# EAGLE design smits-board (EAGLE 9.5.2)
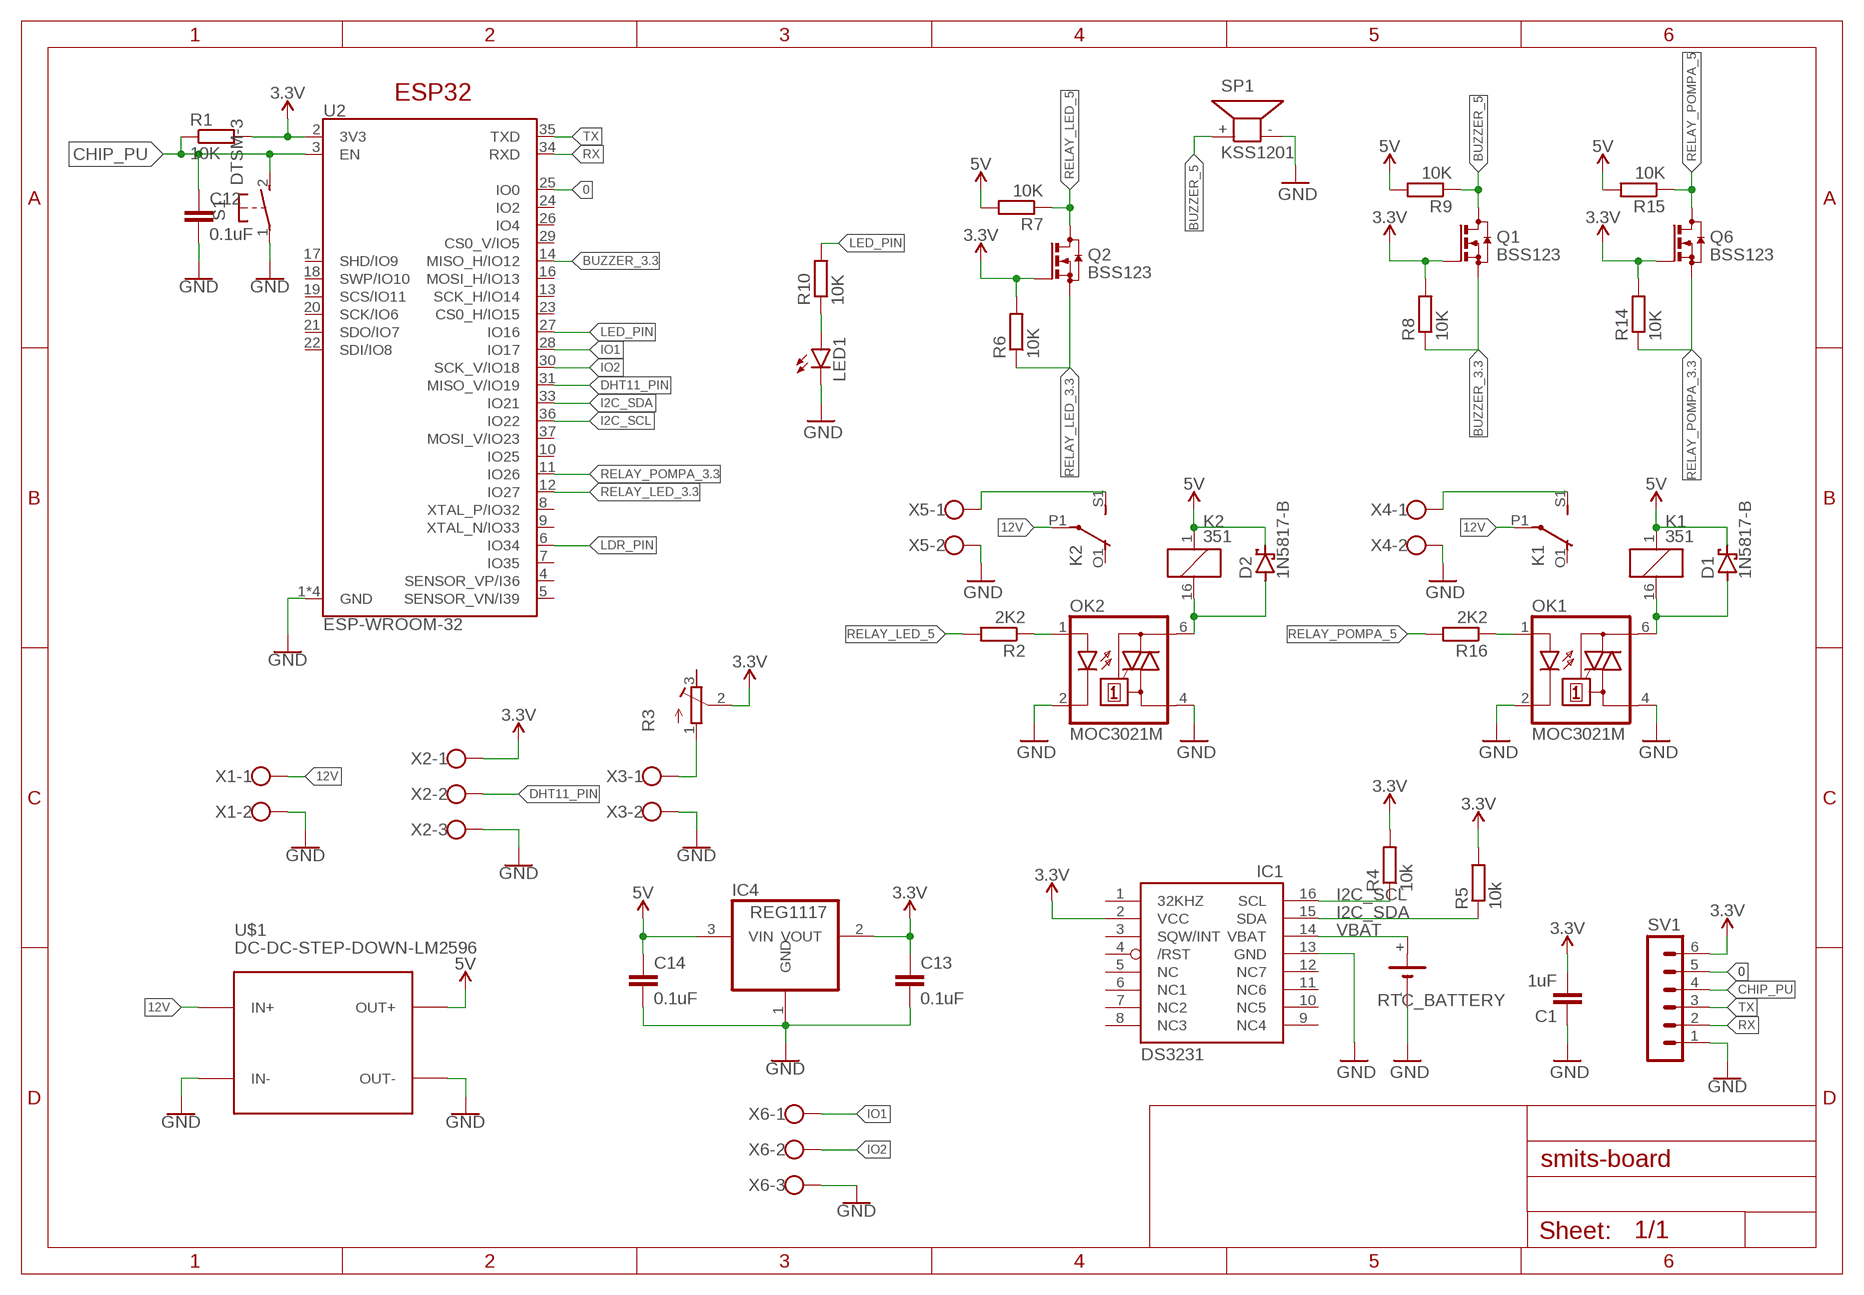
[diagram p0: schematic, sheet 1]

## Parts
C1  1uF  C-EUC0805  [C0805]
C12  0.1uF  C-EUC0805  [C0805]
C13  0.1uF  C-EUC0805  [C0805]
C14  0.1uF  C-EUC0805  [C0805]
D1  1N5817-B  [DO41-7.6]
D2  1N5817-B  [DO41-7.6]
IC1  DS3231/SO  [SO16W]
IC4  REG1117  [SOT223]
K1  351  [351]
K2  351  [351]
LED1  LEDCHIP-LED0805  [CHIP-LED0805]
OK1  MOC3021M  [DIL06]
OK2  MOC3021M  [DIL06]
Q1  BSS123  [SOT23]
Q2  BSS123  [SOT23]
Q6  BSS123  [SOT23]
R1  10K  R-EU_R0805  [R0805]
R2  2K2  R-EU_R0805  [R0805]
R3  R-TRIMM64W  [RTRIM64W]
R4  10k  R-EU_R0805  [R0805]
R5  10k  R-EU_R0805  [R0805]
R6  10K  R-EU_R0805  [R0805]
R7  10K  R-EU_R0805  [R0805]
R8  10K  R-EU_R0805  [R0805]
R9  10K  R-EU_R0805  [R0805]
R10  10K  R-EU_R0805  [R0805]
R14  10K  R-EU_R0805  [R0805]
R15  10K  R-EU_R0805  [R0805]
R16  2K2  R-EU_R0805  [R0805]
RTC_BATTERY  CH291-1220LF  [CH291-1220LF]
S1  DTSM-3  [DTSM-3]
SP1  KSS1201  [KSS1201]
SV1  MA06-1  [MA06-1]
U2  ESP-WROOM-32  [ESP-WROOM-32]
U$1  DC-DC-STEP-DOWN-LM2596  [DC-DC-STEP-DOWN-LM2596]
X1  W237-102  [W237-102]
X2  W237-103  [W237-103]
X3  W237-102  [W237-102]
X4  W237-102  [W237-102]
X5  W237-102  [W237-102]
X6  W237-103  [W237-103]

## Nets
0: SV1.5 U2.25(IO0)
12V: K1.P1(2:P) K2.P1(2:P) U$1.IN+ X1.1
BUZZER_3.3: Q1.2(S) R8.1 U2.14(MISO_H/IO12)
BUZZER_5: Q1.3(D) R9.1 SP1.+
CHIP_PU: C12.1 R1.1 S1.2 SV1.4 U2.3(EN)
DHT11_PIN: U2.31(MISO_V/IO19) X2.2
GND: C1.1 C12.2 C13.2 C14.2 IC1.13(GND) IC4.1(GND) LED1.C OK1.2(C) OK1.4(A1) OK2.2(C) OK2.4(A1) RTC_BATTERY.- S1.1 SP1.- SV1.1 U2.1(GND) U2.15(GND) U2.38(GND) U2.GND U$1.IN- U$1.OUT- X1.2 X2.3 X3.2 X4.2 X5.2 X6.3
I2C_SCL: IC1.16(SCL) R4.1 U2.36(IO22)
I2C_SDA: IC1.15(SDA) R5.1 U2.33(IO21)
IO1: U2.28(IO17) X6.1
IO2: U2.30(SCK_V/IO18) X6.2
LDR_PIN: U2.6(IO34)
LED_PIN: R10.2 U2.27(IO16)
N$1: R3.1(A) X3.1
N$2: D1.A K1.16 OK1.6(A2)
N$3: OK1.1(A) R16.1
N$4: D2.A K2.16 OK2.6(A2)
N$5: LED1.A R10.1
N$6: K1.S1(2:S) X4.1
N$7: OK2.1(A) R2.1
N$9: K2.S1(2:S) X5.1
RELAY_LED_3.3: Q2.2(S) R6.1 U2.12(IO27)
RELAY_LED_5: Q2.3(D) R2.2 R7.1
RELAY_POMPA_3.3: Q6.2(S) R14.1 U2.11(IO26)
RELAY_POMPA_5: Q6.3(D) R15.1 R16.2
RX: SV1.2 U2.34(RXD)
TX: SV1.3 U2.35(TXD)
VBAT: IC1.14(VBAT) RTC_BATTERY.+
VCC_1: C1.2 C13.1 IC1.2(VCC) IC4.2(VOUT) Q1.1(G) Q2.1(G) Q6.1(G) R1.2 R3.2(S) R4.2 R5.2 R6.2 R8.2 R14.2 SV1.6 U2.2(3V3) X2.1 ; supply symbol labelled 3.3V
VCC_2: C14.1 D1.C D2.C IC4.3(VIN) K1.1 K2.1 R7.2 R9.2 R15.2 U$1.OUT+ ; supply symbol labelled 5V
Unconnected: IC1.1(32KHZ) IC1.3(SQW/INT) IC1.4(/RST) IC1.5(NC) IC1.6(NC1) IC1.7(NC2) IC1.8(NC3) IC1.9(NC4) IC1.10(NC5) IC1.11(NC6) IC1.12(NC7) K1.O1(2:O) K1.O2(3:O) K1.P2(3:P) K1.S2(3:S) K2.O1(2:O) K2.O2(3:O) K2.P2(3:P) K2.S2(3:S) R3.3(E) U2.4(SENSOR_VP/I36) U2.5(SENSOR_VN/I39) U2.7(IO35) U2.8(XTAL_P/IO32) U2.9(XTAL_N/IO33) U2.10(IO25) U2.13(SCK_H/IO14) U2.16(MOSI_H/IO13) U2.17(SHD/IO9) U2.18(SWP/IO10) U2.19(SCS/IO11) U2.20(SCK/IO6) U2.21(SDO/IO7) U2.22(SDI/IO8) U2.23(CS0_H/IO15) U2.24(IO2) U2.26(IO4) U2.29(CS0_V/IO5) U2.37(MOSI_V/IO23)

## Notes on the sheet
- ESP32

## Library data of the parts
C1 C12 = rcl:C-EU: CAPACITOR, European symbol; SPICEPREFIX: C
C13 C14 = resistor:C-EU: CAPACITOR, European symbol
D1 D2 = diode:1N581*: 1.0A SCHOTTKY BARRIER RECTIFIER Source: http://www.diodes.com/datasheets/ds23001.pdf
IC1 = adafruit:DS3231
IC4 = burr-brown:REG1117: 800mA and 1A Low Dropout (LDO) Positive Regulator 1.8V, 2.5V, 2.85V, 3.3V, 5V, and Adj; MPN: REG1117; OC_FARNELL: 1097566; OC_NEWARK: 14P6981
K1 K2 = relay:351: RELAY 2 x switch, Omron; OC_FARNELL: unknown; OC_NEWARK: unknown
LED1 = led:LED: LED OSRAM: - CHIPLED LG R971, LG N971, LY N971, LG Q971, LY Q971, LO R971, LY R971 LH N974, LH R974 LS Q976, LO Q976, LY Q976 LO Q996 - Hyper CHIPLED LW Q18S LB Q993, LB Q99A, LB R99A - SideLED LS A670, LO A670, LY A670, LG A670, LP A670 LB A673, LV A673, LT A673, LW A673 LH A674 LY A675 LS A676, LA A676, LO A676, LY A676, LW A676 LS A679, LY A679, LG A679 - Hyper Micro SIDELED® LS Y876, LA Y876, LO Y876, LY Y876 LT Y87S - SmartLED LW L88C, LW L88S LB L89C, LB L89S, LG L890 LS L89K, LO L89K, LY L89K LS L896, LA L896, LO L896, LY L896 - TOPLED LS T670, LO T670, LY T670, LG T670, LP T670 LSG T670, LSP T670, LSY T670, LOP T670, LYG T670 LG T671, LOG T671, LSG T671 LB T673, LV T673, LT T673, LW T673 LH T674 LS T676, LA T676, LO T676, LY T676, LB T676, LH T676, LSB T676, LW T676 LB T67C, LV T67C, LT T67C, LS T67K, LO T67K, LY T67K, LW E67C LS E67B, LA E67B, LO E67B, LY E67B, LB E67C, LV E67C, LT E67C LW T67C LS T679, LY T679, LG T679 LS T770, LO T770, LY T770, LG T770, LP T770 LB T773, LV T773, LT T773, LW T773 LH T774 LS E675, LA E675, LY E675, LS T675 LS T776, LA T776, LO T776, LY T776, LB T776 LHGB T686 LT T68C, LB T68C - Hyper Mini TOPLED® LB M676 - Mini TOPLED Santana® LG M470 LS M47K, LO M47K, LY M47K Source: http://www.osram.convergy.de LUXEON: - LUMILED® LXK2-PW12-R00, LXK2-PW12-S00, LXK2-PW14-U00, LXK2-PW14-V00 LXK2-PM12-R00, LXK2-PM12-S00, LXK2-PM14-U00 LXK2-PE12-Q00, LXK2-PE12-R00, LXK2-PE12-S00, LXK2-PE14-T00, LXK2-PE14-U00 LXK2-PB12-K00, LXK2-PB12-L00, LXK2-PB12-M00, LXK2-PB14-N00, LXK2-PB14-P00, LXK2-PB14-Q00 LXK2-PR12-L00, LXK2-PR12-M00, LXK2-PR14-Q00, LXK2-PR14-R00 LXK2-PD12-Q00, LXK2-PD12-R00, LXK2-PD12-S00 LXK2-PH12-R00, LXK2-PH12-S00 LXK2-PL12-P00, LXK2-PL12-Q00, LXK2-PL12-R00 Source: www.luxeon.com KINGBRIGHT: KA-3528ASYC Source: www.kingbright.com
OK1 OK2 = optocoupler:MOC30*M: RANDOM-PHASE OPTOISOLATORS TRIAC DRIVER OUTPUT Source: http://www.fairchildsemi.com MOC3020-M.pdf; MF: FAIRCHILD SEMICONDUCTOR; MPN: MOC3021-M; OC_FARNELL: 1021365; OC_NEWARK: 95B7895
Q1 Q2 Q6 = transistor-small-signal:BSS123: N-CHANNEL MOS FET
R1 R4 R5 = rcl:R-EU_: RESISTOR, European symbol; SPICEPREFIX: R
R2 R6-R10 R14-R16 = resistor:R-EU_: RESISTOR, European symbol
R3 = rcl:R-TRIMM: Trimm resistor; SPICEMODEL: X; SPICEPREFIXL: POT
RTC_BATTERY = battery:CH291-1220LF: Battery Holder, SMT, 12mm multicomp PART NO. CH291-1220LF Source: Data sheet <http://www.farnell.com/datasheets/1505860.pdf>
S1 = switch-tact:DTSM-3
SP1 = buzzer:KSS1201: SPEAKER Source: Schukat; OC_FARNELL: unknown; OC_NEWARK: unknown
SV1 = con-lstb:MA06-1: PIN HEADER; OC_FARNELL: unknown; OC_NEWARK: unknown
U2 = SparkFun-RF:ESP-WROOM-32; PROD_ID: IC-13849
U$1 = diy-modules:DC-DC-STEP-DOWN-LM2596: DC/DC Step-Down Regulator based on LM2596-ADJ chip LM2596 datasheet available here: http://www.ti.com/lit/ds/symlink/lm2596.pdf Click here to find device on ebay.com <http://www.ebay.com/sch/lm2596+power+regulator>
X1 X3-X5 = con-wago-500:W237-102: WAGO SCREW CLAMP; MPN: 237-102; OC_FARNELL: unknown; OC_NEWARK: 70K9898
X2 X6 = con-wago-500:W237-103: WAGO SCREW CLAMP; MPN: 237-103; OC_FARNELL: unknown; OC_NEWARK: 18M7116

## Board
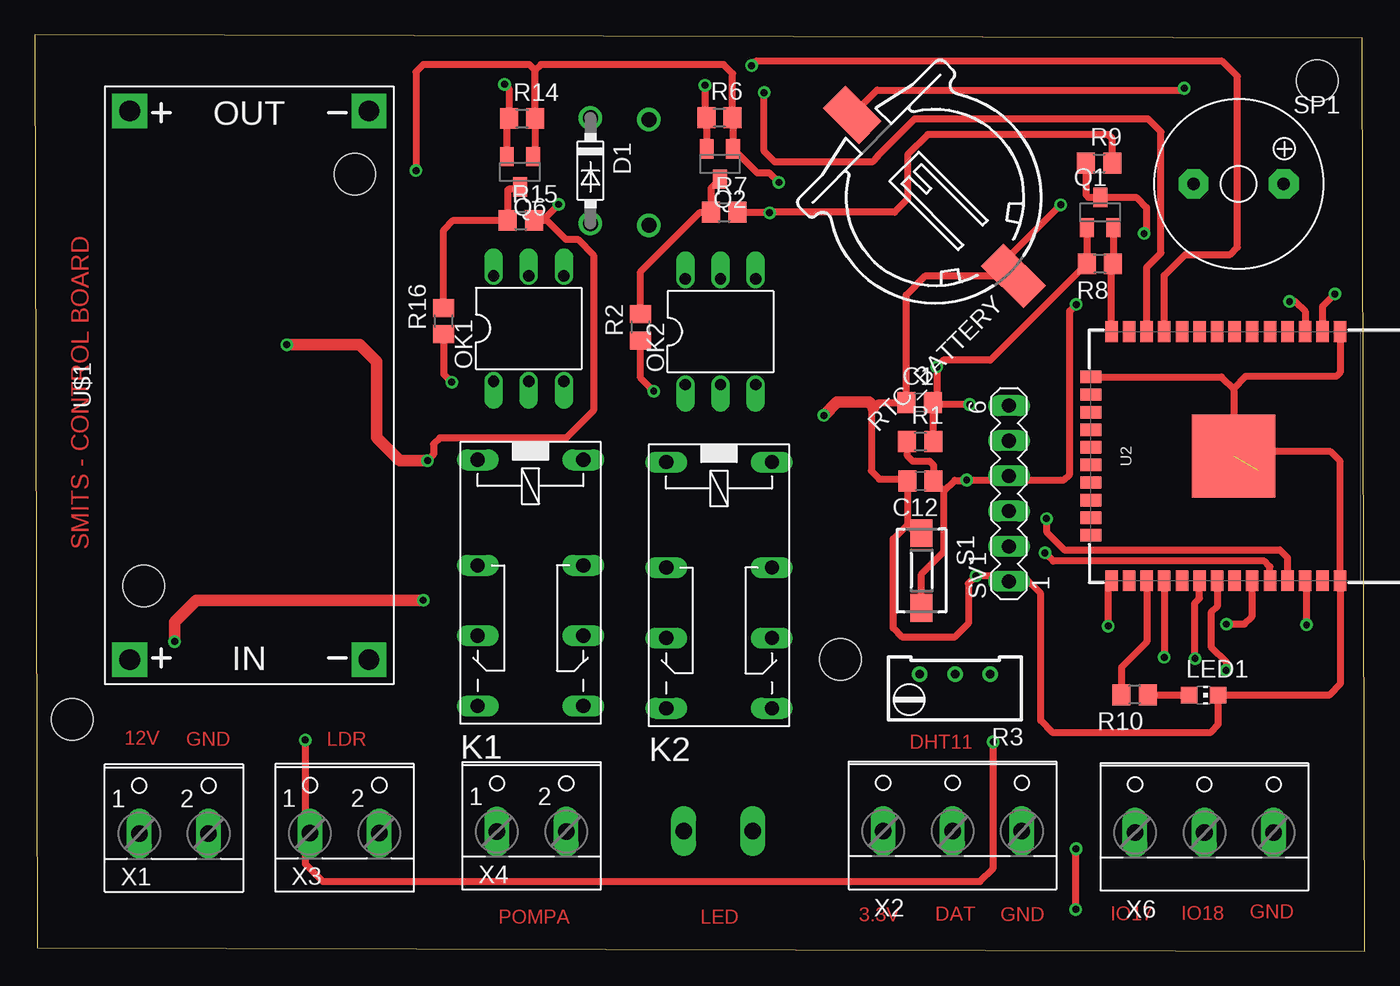
[diagram p1: board, top side]
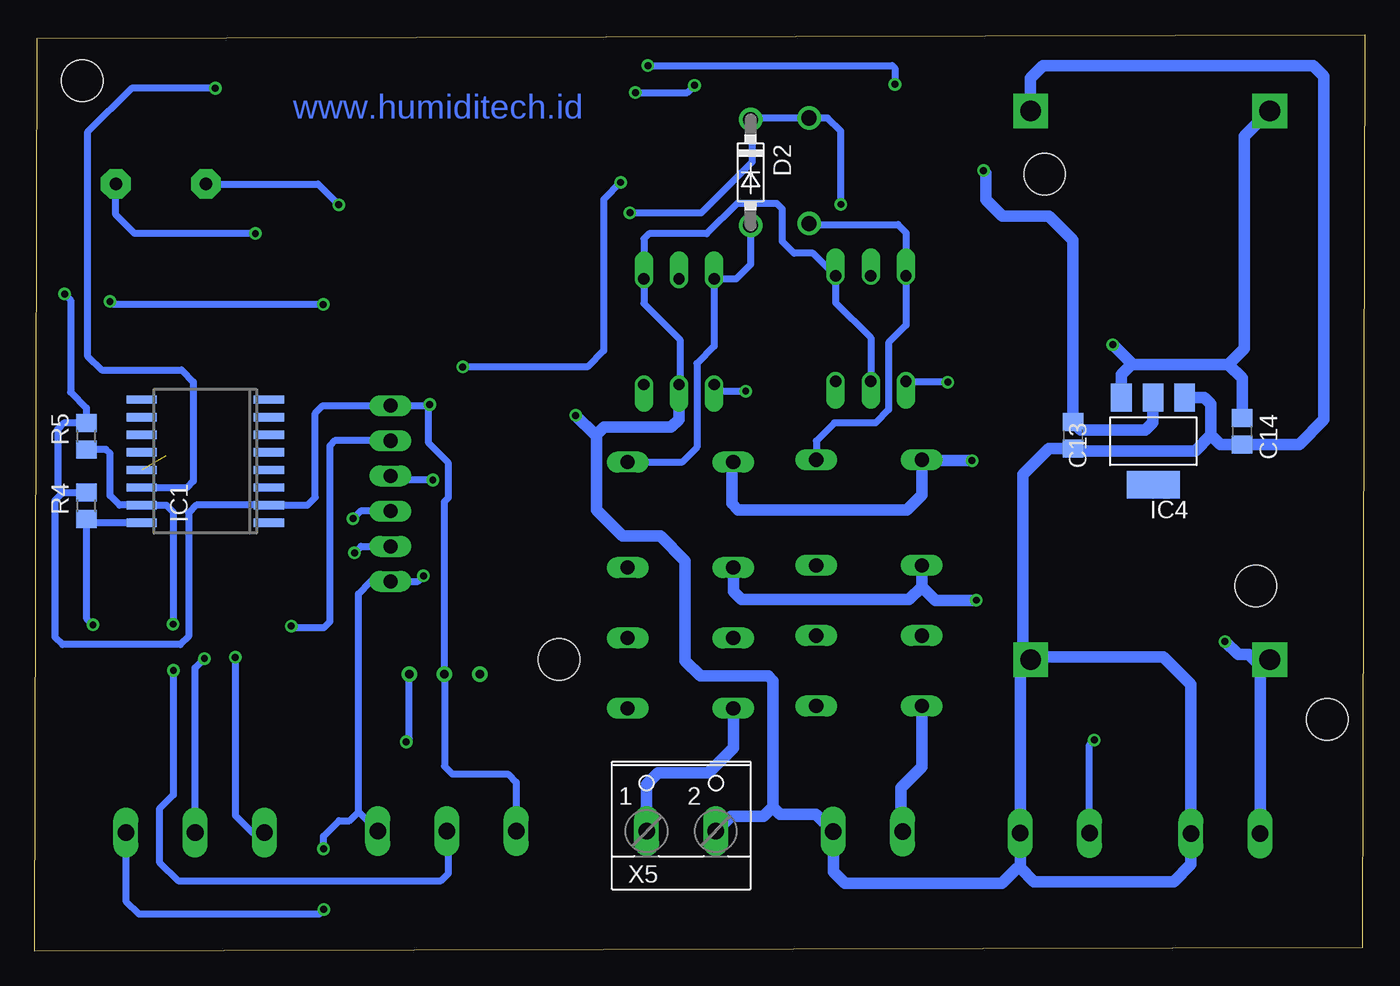
[diagram p2: board, bottom side, seen from below]

Size 96.04 x 66.19 mm. Coordinates in mm from the lower left corner, seen from the top.
Outline: 0.18,0.26 96.04,0 95.86,65.93 0,66.19 0.18,0.26
Copper layers (1*16): Top 0.035mm / dielectric 1.5mm / Bottom 0.035mm
Design rules "default": minimum track width 6mil, minimum drill 0.35mm, track to track 6mil, track to pad 6mil, pad to pad 6mil, via to via 6mil, smd to smd 6mil, copper to edge 40mil, drill to drill 6mil, minimum pad ring 10mil, minimum via ring 8mil, stop-mask expansion 4mil, vias tented up to drill 0mil, thermal gap 10mil
Holes 3 mm at 92.61,62.85 58.18,21.07 2.71,16.75

### Footprints (pad centres in the part's own frame; a part is rotated, then mirrored left to right if it is on the bottom)
C0805 = smd 1.3 x 1.5: 1 -0.95,0; 2 0.95,0
DO41-7.6 = drill 1.1 pad 1.7: A 3.81,0; C -3.81,0
SO16W = smd 0.6 x 2.2: 1 -4.445,-4.6; 2 -3.175,-4.6; 3 -1.905,-4.6; 4 -0.635,-4.6; 5 0.635,-4.6; 6 1.905,-4.6; 7 3.175,-4.6; 8 4.445,-4.6; 9 4.445,4.6; 10 3.175,4.6; 11 1.905,4.6; 12 0.635,4.6; 13 -0.635,4.6; 14 -1.905,4.6; 15 -3.175,4.6; 16 -4.445,4.6
SOT223 = smd 1.499 x 2.007: 1 -2.261,-3.15; 2 0.025,-3.15; 3 2.311,-3.15 | smd 3.81 x 2.007: 4 0,3.15
351 = drill 1.016 long: 1 -3.81,-3.81; 16 -3.81,3.81; O1 8.89,-3.81; O2 8.89,3.81; P1 3.81,-3.81; P2 3.81,3.81; S1 13.97,-3.81; S2 13.97,3.81
CHIP-LED0805 = smd 1.2 x 1.2: A 0,-1.05; C 0,1.05
DIL06 = drill 0.813 offset: 1 -2.54,-3.81; 2 0,-3.81; 3 2.54,-3.81; 4 2.54,3.81; 5 0,3.81; 6 -2.54,3.81
SOT23 = smd 1 x 1.4: 1 -0.95,-1.1; 2 0.95,-1.1; 3 0,1.1
R0805 = smd 1.3 x 1.5: 1 -0.95,0; 2 0.95,0
RTRIM64W = drill 0.61: 1 1.27,-2.54; 2 1.27,0; 3 1.27,2.54
CH291-1220LF = smd 2.3 x 3.66: + 0,-2.296 | smd 2.3 x 4.3: - 0,14.146
DTSM-3 = smd 2 x 1.6: 1 -2.7,0; 2 2.7,0
KSS1201 = drill 0.914 pad 2.159 octagon: + 3.251,0; - -3.251,0
MA06-1 = drill 1.016 long: 1 -6.35,0; 2 -3.81,0; 3 -1.27,0; 4 1.27,0; 5 3.81,0; 6 6.35,0
ESP-WROOM-32 = smd 0.9 x 1.5: 1 7.7,9; 2 6.43,9; 3 5.16,9; 4 3.89,9; 5 2.62,9; 6 1.35,9; 7 0.08,9; 8 -1.19,9; 9 -2.46,9; 10 -3.73,9; 11 -5,9; 12 -6.27,9; 13 -7.54,9; 14 -8.81,9; 25 -8.81,-9; 26 -7.54,-9; 27 -6.27,-9; 28 -5,-9; 29 -3.73,-9; 30 -2.46,-9; 31 -1.19,-9; 32 0.08,-9; 33 1.35,-9; 34 2.62,-9; 35 3.89,-9; 36 5.16,-9; 37 6.43,-9; 38 7.7,-9 | smd 1.5 x 0.9: 15 -10.3,5.715; 16 -10.3,4.445; 17 -10.3,3.175; 18 -10.3,1.905; 19 -10.3,0.635; 20 -10.3,-0.635; 21 -10.3,-1.905; 22 -10.3,-3.175; 23 -10.3,-4.445; 24 -10.3,-5.715 | smd 6 x 6: GND 0,0
DC-DC-STEP-DOWN-LM2596 = drill 1.5 pad 2.5 square: IN+ -19.812,8.636; IN- -19.812,-8.636; OUT+ 19.812,8.636; OUT- 19.812,-8.636 | hole 3: -14.478,7.62; 15.24,-7.62
W237-102 = drill 1.194 long: 1 -2.5,-1.27; 2 2.5,-1.27
W237-103 = drill 1.194 long: 1 -5,-1.29; 2 0,-1.29; 3 5,-1.29

### Placement (x,y rotation side)
C1  63.89,39.62 0 top
C12  63.95,33.96 180 top
C13  21.07,37.25 270 bottom
C14  8.86,37.54 270 bottom
D1  40.13,56.36 270 top
D2  44.35,56.24 270 bottom
IC1  83.71,35.39 90 bottom
IC4  15.27,36.84 180 bottom
K1  35.8,31.68 270 top
K2  49.41,31.51 270 top
LED1  84.39,18.49 270 top
OK1  35.67,44.97 0 top
OK2  49.52,44.74 0 top
Q1  76.93,53.35 0 top
Q2  49.48,56.85 180 top
Q6  35.04,56.28 180 top
R1  63.94,36.81 0 top
R2  43.75,45.06 90 top
R3  66.45,18.74 90 top
R4  92.3,32.17 90 bottom
R5  92.3,37.19 90 bottom
R6  49.45,60.2 0 top
R7  49.79,53.37 0 top
R8  76.91,49.64 180 top
R9  76.85,56.9 0 top
R10  79.41,18.52 180 top
R14  35.19,60.13 0 top
R15  35.1,52.78 0 top
R16  29.53,45.51 90 top
RTC_BATTERY  60.66,58.78 225 top
S1  64.03,27.49 270 top
SP1  86.92,55.41 0 top
SV1  70.35,33.05 90 top
U2  86.56,35.75 0 top
U$1  15.5,40.87 90 top
X1  10.06,9.76 0 top
X2  66.27,9.97 0 top
X3  22.38,9.79 0 top
X4  35.88,9.92 0 top
X5  49.36,9.94 0 bottom
X6  84.45,9.87 0 top

### Tracks (layer width: path | path; a pad name or v marks a point on that pad's centre or on a via)
0  (via drill 0.5)
  Top 0.508: v77.51,23.49 77.51,26.52 U2.25
  Bottom 0.508: SV1.5 74.38,36.86 74.74,36.5 74.74,23.79 75.17,23.36 77.38,23.36 v77.51,23.49
12V  (via drill 0.5)
  Top 0.813: v28.06,25.35 11.68,25.35 10.1,23.77 v10.1,22.37
  Bottom 0.813: 7.56,20.36 X1.1 | U$1.IN+ 7.56,20.36 | K2.P1 45.6,25.98 45.01,25.39 32.92,25.39 31.99,26.32 | K1.P1 31.99,26.32 | 31.99,26.32 31.02,25.35 v28.06,25.35 | v10.1,22.37 9.15,21.42 8.39,21.42 7.56,20.59 7.56,20.36
BUZZER_3.3
  Top 0.508: Q1.2 77.88,49.66 R8.1 77.75,49.53 U2.14
BUZZER_5  (via drill 0.5)
  Top 0.508: R9.1 75.9,54.62 76.07,54.45 Q1.3 79.53,54.45 80.27,53.71 80.27,52 v80.1,51.83
  Bottom 0.508: v80.1,51.83 88.82,51.83 90.18,53.19 SP1.+
CHIP_PU  (via drill 0.5)
  Top 0.508: R1.1 62.99,35.8 63.39,35.4 64.61,35.4 64.91,35.1 C12.1 65.65,33.22 | S1.2 64.03,27.24 65.65,28.86 65.65,33.22 | 65.65,33.22 66.43,34 67.19,34 67.22,33.96 v67.29,34.03 74.32,34.03 74.73,34.44 74.73,46.23 v75.2,46.7 | v90.6,46.92 91.01,46.92 91.72,46.21 U2.3
  Bottom 0.508: v67.29,34.03 70.05,34.03 SV1.4 | v75.2,46.7 90.38,46.7 v90.6,46.92
DHT11_PIN  (via drill 0.5)
  Top 0.508: U2.31 85.37,24.89 84.93,24.45 84.93,21.99 86.02,20.9 v86.02,20.28
  Bottom 0.508: v86.02,20.28 86.02,11.29 87.04,10.27 87.04,6.44 85.69,5.09 66.7,5.09 66.16,5.63 66.16,8.57 X2.2
GND  (via drill 0.5)  (1 unrouted)
  Top 0.508: 63,30.78 C12.2 62.87,34.1 60.99,34.1 60.4,34.69 60.4,39.09 60.61,39.3 60.93,39.62 C1.1 62.94,47.39 64.33,48.78 70.29,48.78 | S1.1 63.6,30.19 63,30.78 | 63,30.78 62,29.78 62,23.34 62.66,22.68 66.39,22.68 67.4,23.69 67.4,26.55 v67.96,27.11 71.36,27.11 72.64,25.83 72.64,16.67 73.53,15.78 84.87,15.78 85.44,16.35 LED1.C 93.46,18.49 94.26,19.29 U2.38 94.26,35.39 93.57,36.08 86.56,36.08 | U2.15 85.69,41.47 86.56,40.6 | 86.56,40.6 86.56,36.08 | 86.56,36.08 U2.GND | U2.1 94.26,41.8 93.96,41.5 87.42,41.5 86.56,40.64 86.56,40.6 | 70.29,48.78 RTC_BATTERY.- | v74.08,53.91 70.29,50.12 70.29,48.78 | v75.16,3.02 75.16,7.38 v75.18,7.4
  Top 0.813: v56.98,38.7 57.94,39.66 60.25,39.66 60.61,39.3
  Bottom 0.508: OK1.2 35.67,44.3 38.21,46.84 OK1.4 39.84,50.41 41.2,50.41 42.05,51.26 42.05,53.6 42.45,54 45.33,54 47.52,51.81 51.7,51.81 52.06,51.45 OK2.4 52.06,46.77 49.46,44.17 49.46,40.99 OK2.2 | X2.3 72.66,10.07 | 72.66,10.07 72.66,25.81 71.77,26.7 SV1.1 68.36,26.7 v67.96,27.11 | SP1.- 75.58,55.41 v74.08,53.91 | X6.3 89.45,3.62 88.52,2.69 75.49,2.69 v75.16,3.02 | v75.18,7.4 75.18,8.31 74.07,9.42 73.31,9.42 72.66,10.07
  Bottom 0.813: 23.93,21.26 14.56,21.26 12.56,19.26 X1.2 12.56,6.27 13.8,5.03 23.9,5.03 24.88,6.01 | 23.93,21.26 U$1.IN- 24.88,20.31 X3.2 24.88,6.01 | 11.11,37.28 11.11,39.51 11.59,39.99 IC4.1 | 11.11,37.28 10.42,36.59 C14.2 4.75,36.59 2.95,38.39 2.95,63.17 3.71,63.93 23.26,63.93 24.14,63.05 U$1.OUT- | 11.11,37.28 12.25,36.14 20.91,36.14 C13.2 22.82,36.3 24.7,34.42 24.7,22.03 23.93,21.26 | X5.2 45.78,9.75 43.41,9.75 42.78,10.38 42.72,10.38 | 24.88,6.01 25.09,6.01 26.2,4.9 37.54,4.9 38.38,5.74 X4.2 39.62,9.89 42.23,9.89 42.72,10.38 | OK2.2 49.52,38.4 50.08,37.84 54.94,37.84 55.47,37.31 | 55.47,37.31 55.47,31.88 53.58,29.99 50.87,29.99 49.07,28.19 49.07,20.97 47.97,19.87 43.07,19.87 42.72,19.52 42.72,10.38 | 55.47,37.31 55.59,37.31 v56.98,38.7
I2C_SCL  (via drill 0.5)
  Top 0.508: v91.83,23.58 91.83,26.65 U2.36
  Bottom 0.508: IC1.16 92.03,30.95 R4.1 92.3,24.05 v91.83,23.58
I2C_SDA  (via drill 0.5)
  Top 0.508: v86.04,23.62 87.35,23.62 87.91,24.18 U2.33
  Bottom 0.508: R5.1 90.89,36.24 90.6,35.95 90.6,32.91 89.91,32.21 IC1.15 86.53,32.21 86.04,31.73 v86.04,23.62
IO1  (via drill 0.5)
  Top 0.508: U2.28 v81.56,21.24 v81.55,21.23
  Bottom 0.508: v81.55,21.23 81.55,9.8 80.33,8.58 X6.1
IO2  (via drill 0.5)
  Top 0.508: v83.78,21.14 83.78,25.17 84.1,25.49 U2.30
  Bottom 0.508: X6.2 84.45,20.47 v83.78,21.14
LED_PIN
  Top 0.508: U2.27 80.29,22.34 78.46,20.51 R10.2
N$1  (via drill 0.5)
  Top 0.508: v19.54,15.25 19.54,6.3 20.8,5.04 68.25,5.04 69.21,6 v69.21,15.12
  Bottom 0.508: X3.1 19.88,14.91 v19.54,15.25 | v69.21,15.12 68.99,15.34 R3.1
N$2
  Bottom 0.508: D1.A 40.05,52.47 33.71,52.47 33.13,51.89 OK1.6 33.13,45.21 34.39,43.95 34.39,39.1 35.33,38.16 38.31,38.16 39.61,36.86 K1.16
N$3  (via drill 0.5)
  Top 0.508: R16.1 29.53,41.67 v30.11,41.09
  Bottom 0.508: v30.11,41.09 33.06,41.09 OK1.1
N$4
  Bottom 0.508: D2.A 44.35,49.6 45.4,48.55 OK2.6 46.98,43.69 48.22,42.45 48.22,36.39 49.31,35.3 53.2,35.3 K2.16
N$5
  Top 0.508: R10.1 83.31,18.52 LED1.A
N$6
  Bottom 0.813: K1.S1 31.99,13.3 33.49,11.8 33.49,8.76 X4.1
N$7  (via drill 0.5)
  Top 0.508: v44.7,40.45 43.75,41.4 R2.1
  Bottom 0.508: OK2.1 46.5,40.45 v44.7,40.45
N$9
  Bottom 0.813: K2.S1 45.6,14.68 47.38,12.9 51.02,12.9 51.86,12.06 X5.1
RELAY_LED_3.3  (via drill 0.5)
  Top 0.508: R6.1 48.5,59.97 | 48.5,59.97 48.5,57.98 Q2.2 | U2.12 80.29,49.39 81.32,50.42 81.32,59.18 80.4,60.1 63.53,60.1 60.86,57.43 60.86,57.38 60.47,56.99 53.45,56.99 52.67,57.77 v52.67,62.01 | v48.4,62.53 48.4,60.07 48.5,59.97
  Bottom 0.508: v52.67,62.01 48.92,62.01 v48.4,62.53
RELAY_LED_5
  Top 0.508: Q2.3 48.84,55.11 R7.1 48.05,53.37 43.75,49.07 R2.2
RELAY_POMPA_3.3  (via drill 0.5)
  Top 0.508: Q6.2 34.09,59.98 R14.1 34.24,62.29 v33.93,62.6 | U2.11 81.56,48.8 83.08,50.32 86.32,50.32 86.84,50.84 86.84,63.17 85.75,64.26 52.06,64.26 v51.76,63.96
  Bottom 0.508: v51.76,63.96 34.11,63.96 33.93,63.78 v33.93,62.6
RELAY_POMPA_5
  Top 0.508: Q6.3 34.89,55.03 34.21,55.03 34.15,54.97 R15.1 30.22,52.78 29.53,52.09 R16.2
RX  (via drill 0.5)
  Top 0.508: U2.34 89.18,27.76 88.77,28.17 73.55,28.17 v72.95,28.77
  Bottom 0.508: v72.95,28.77 72.47,29.24 SV1.2
TX  (via drill 0.5)
  Top 0.508: v73.05,31.24 73.05,30.28 74.34,28.99 89.89,28.99 90.45,28.43 U2.35
  Bottom 0.508: SV1.3 72.5,31.78 v73.05,31.24
VBAT  (via drill 0.5)
  Top 0.508: RTC_BATTERY.+ 60.82,62.19 82.86,62.19 v82.99,62.32
  Bottom 0.508: v82.99,62.32 89.04,62.32 92.23,59.13 92.23,42.99 91.21,41.97 85.43,41.97 84.58,41.12 84.58,33.95 85.07,33.46 88.28,33.46 IC1.14
VCC_1  (via drill 0.5)
  Top 0.508: Q6.1 36.14,57.53 R14.2 36.14,63.62 | 36.14,63.62 35.73,64.03 28.06,64.03 27.53,63.5 v27.53,56.38 | 36.14,63.62 36.55,64.03 49.74,64.03 50.4,63.37 R6.2 50.43,60.17 Q2.1 52.16,56.22 53.03,56.22 v53.73,55.52 | Q1.1 75.98,49.66 R8.2 69,42.68 65.61,42.68 v65.13,42.2 65.13,39.91 C1.2 | v67.52,39.48 64.98,39.48 C1.2 | R1.2 64.89,39.57 C1.2 | U2.2 92.99,46.57 v93.88,47.46
  Bottom 0.508: 94.02,33.12 R4.2 | 94.02,33.12 94.39,33.49 94.39,37.69 93.94,38.14 R5.2 92.3,39.24 93.44,40.38 93.44,47.02 v93.88,47.46 | 94.02,33.12 94.56,32.58 94.56,22.68 94.02,22.14 85.52,22.14 84.93,22.73 84.93,31.65 84.37,32.21 IC1.2 76.33,32.21 75.78,32.77 75.78,38.86 75.23,39.41 SV1.6 67.59,39.41 | 67.59,39.41 v67.52,39.48 | X2.1 61.27,12.21 61.87,12.81 65.89,12.81 66.45,13.37 R3.2 66.45,32.46 66.16,32.75 66.16,35.25 67.59,36.68 67.59,39.41 | v53.73,55.52 54.96,54.29 54.96,43.37 56.13,42.2 v65.13,42.2
  Bottom 0.813: IC4.2 15.29,38.17 15.84,37.63 20.5,37.63 C13.1 21.07,51.36 22.8,53.09 26.17,53.09 27.35,54.27 27.35,56.2 v27.53,56.38
VCC_2  (via drill 0.5)
  Top 0.508: v37.84,53.93 36.69,52.78 R15.2 36.97,52.78 38.34,51.41 39.22,51.41 40.35,50.28 40.35,39.04 38.38,37.07 29.26,37.07 28.8,36.61 28.8,35.87 v28.36,35.43 | R7.2 53.02,53.37 | 53.02,53.37 v53.06,53.33 | R9.2 77.8,58.71 77.53,58.98 64.49,58.98 63.02,57.51 63.02,54.3 62.09,53.37 53.02,53.37
  Top 0.813: v18.2,43.8 23.45,43.8 24.68,42.57 24.68,37.1 26.35,35.43 v28.36,35.43
  Bottom 0.508: 44.23,60.17 D1.C 38.79,60.17 37.84,59.22 v37.84,53.93 | 44.23,60.17 D2.C | v53.06,53.33 47.9,53.33 44.23,57 44.23,60.17
  Bottom 0.813: C14.1 8.86,41.38 9.85,42.37 | 9.85,42.37 16.86,42.37 | IC4.3 17.58,41.65 16.86,42.37 | U$1.OUT+ 8.69,58.86 8.69,43.53 9.85,42.37 | 16.86,42.37 16.86,42.46 v18.2,43.8 | v28.36,35.43 31.93,35.43 K1.1 31.99,32.94 33.05,31.88 45.26,31.88 45.7,32.32 45.7,35.22 K2.1

### Text on the board
Top: SMITS - CONTROL BOARD | 12V | GND | LDR | DHT11 | POMPA | LED | 3.3V | DAT | GND | IO17 | IO18 | GND
Bottom: www.humiditech.id